# Altium schematic sheet Power.SchDoc
size A4; SheetNumber: 2; SheetTotal: 3
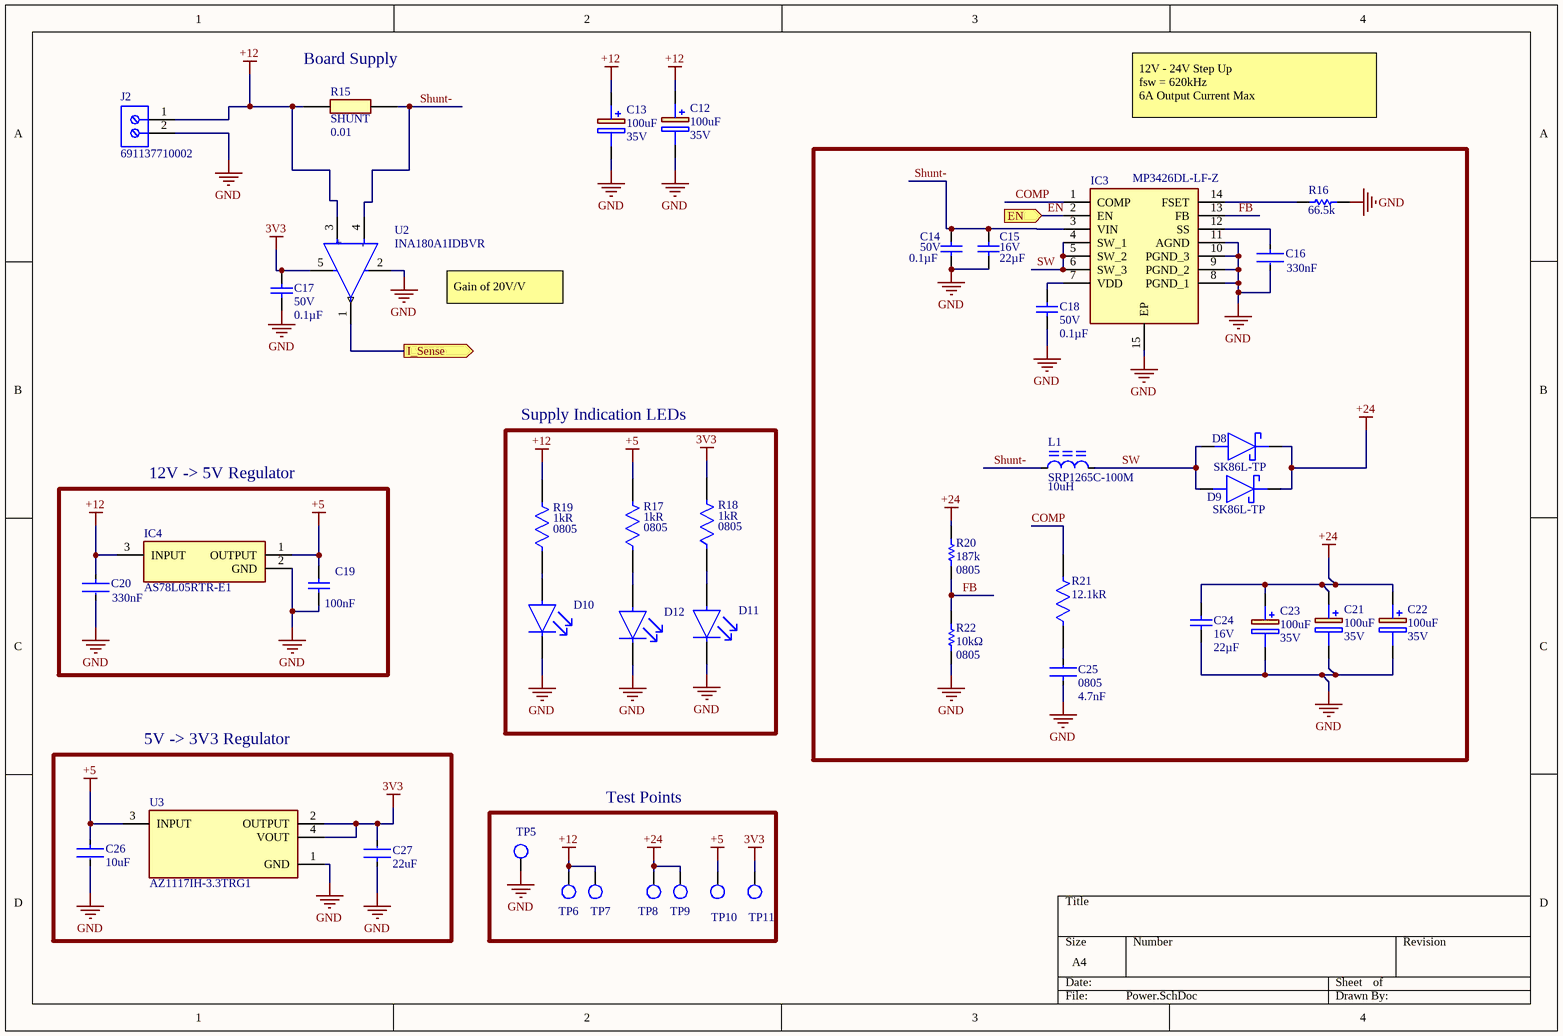
[diagram p0: Power.SchDoc]

## Parts
C12  Capacitance: 100uF  Voltage Rating: 35V  [CAPPRD250W52D630H1250]  (hidden comment: 860010573007)
C13  Capacitance: 100uF  Voltage Rating: 35V  [CAPPRD250W52D630H1250]  (hidden comment: 860010573007)
C14  Voltage - Rated: 50V  Capacitance: 0.1µF  [CAP0805]  (hidden comment: C0805C104K5RACTU)
C15  Voltage - Rated: 16V  Capacitance: 22µF  [CAP0805]  (hidden comment: CL21A226MOCLRNC)
C16  Capacitance: 330nF  [FP-CL21-F-IPC_C]  (hidden comment: CL21B334KBFNNNE)
C17  Voltage - Rated: 50V  Capacitance: 0.1µF  [CAP0805]  (hidden comment: C0805C104K5RACTU)
C18  Voltage - Rated: 50V  Capacitance: 0.1µF  [CAP0805]  (hidden comment: C0805C104K5RACTU)
C19  Capacitance: 100nF  [CAPC2013X140X50ML20T25]  (hidden comment: 08055D104KAT2A)
C20  Capacitance: 330nF  [FP-CL21-F-IPC_C]  (hidden comment: CL21B334KBFNNNE)
C21  Capacitance: 100uF  Voltage Rating: 35V  [CAPPRD250W52D630H1250]  (hidden comment: 860010573007)
C22  Capacitance: 100uF  Voltage Rating: 35V  [CAPPRD250W52D630H1250]  (hidden comment: 860010573007)
C23  Capacitance: 100uF  Voltage Rating: 35V  [CAPPRD250W52D630H1250]  (hidden comment: 860010573007)
C24  Voltage - Rated: 16V  Capacitance: 22µF  [CAP0805]  (hidden comment: CL21A226MOCLRNC)
C25  Case Code (Imperial): 0805  Capacitance: 4.7nF  [FP-CL21-IPC_A]  (hidden comment: CL21B472KBANNNC)
C26  Capacitance: 10uF  [FP-CL21-IPC_B]  (hidden comment: CL21A106KOQNNNE)
C27  Capacitance: 22uF  [FP-CL21-IPC_B]  (hidden comment: CL21A226MQQNNNG)
D8  SK86L-TP  [DIOM7959X262N]
D9  SK86L-TP  [DIOM7959X262N]
D10  150060VS75000  [FP-150060VS75000-MFG]  (value not drawn)
D11  150060VS75000  [FP-150060VS75000-MFG]  (value not drawn)
D12  150060VS75000  [FP-150060VS75000-MFG]  (value not drawn)
IC3  MP3426DL-LF-Z  [SON50P300X400X100-15N-D]
IC4  AS78L05RTR-E1  [DIODES_SOT-89]
J2  691137710002  [691137710002]
L1  SRP1265C-100M  Inductance: 10uH  [FP-SRP1265C-MFG]
R15  SHUNT  Resistance: 0.01  [RESC6434X90N]
R16  Resistance: 66.5k  [RESC2013X70X40LL20T20]  (hidden comment: ERJ-6ENF6652V)
R17  Resistance: 1kR  Size Code: 0805  [FP-RNCP0805-MFG]  (hidden comment: RNCP0805FTD1K00)
R18  Resistance: 1kR  Size Code: 0805  [FP-RNCP0805-MFG]  (hidden comment: RNCP0805FTD1K00)
R19  Resistance: 1kR  Size Code: 0805  [FP-RNCP0805-MFG]  (hidden comment: RNCP0805FTD1K00)
R20  Resistance: 187k  Package: 0805  [RESC2013X70X40NL20T20]  (hidden comment: ERJ-6ENF1873V)
R21  Resistance: 12.1kR  [FP-RNCP0805-IPC_B]  (hidden comment: RNCP0805FTD12K1)
R22  Resistance: 10kΩ  Package / Case: 0805  [RES0805]  (hidden comment: RC0805FR-0710KL)
TP5  GND  [TESTPOINT_LOOP]  (value not drawn)
TP6  12V  [TESTPOINT_LOOP]  (value not drawn)
TP7  12V  [TESTPOINT_LOOP]  (value not drawn)
TP8  24V  [TESTPOINT_LOOP]  (value not drawn)
TP9  24V  [TESTPOINT_LOOP]  (value not drawn)
TP10  5V  [TESTPOINT_LOOP]  (value not drawn)
TP11  3V3  [TESTPOINT_LOOP]  (value not drawn)
U2  INA180A1IDBVR  [FP-DBV0005A-IPC_A]
U3  AZ1117IH-3.3TRG1  [FP-SOT223-IPC_B]

## Blocks framed on the sheet
Supply Indication LEDs: D10-D12 R17-R19
12V -> 5V Regulator: C19 C20 IC4
5V -> 3V3 Regulator: C26 C27 U3
Test Points: TP5-TP11

## Ports
EN (in), I_Sense (out)

## Nets
3V3: C17.2 C27.2 R18.2 TP11.1 U2.5(VS) U3.2(OUTPUT) U3.4(VOUT)
+5: C19.2 C26.1 IC4.1(OUTPUT) R17.2 TP10.1 U3.3(INPUT)
+12: C12.1(+) C13.1(+) C20.1 IC4.3(INPUT) J2.1 R15.1 R19.2 TP6.1 TP7.1 U2.3(IN+)
+24: C21.1(+) C22.1(+) C23.1(+) C24.2 D8.1(K) D9.1(K) R20.1 TP8.1 TP9.1
GND: C12.2(-) C13.2(-) C14.1 C15.1 C16.2 C17.1 C18.1 C19.1 C20.2 C21.2(-) C22.2(-) C23.2(-) C24.1 C25.1 C26.2 C27.1 D10.1(C) D11.1(C) D12.1(C) IC3.8(PGND_1) IC3.9(PGND_2) IC3.10(PGND_3) IC3.11(AGND) IC3.15(EP) IC4.2(GND) J2.2 R16.1 R22.1 TP5.1 U2.2(GND) U3.1(GND)
COMP: IC3.1(COMP) R21.2
EN: IC3.2(EN) ; port EN
FB: IC3.13(FB) R20.2 R22.2
I_Sense: U2.1(OUT) ; port I_Sense
Shunt-: C14.2 C15.2 IC3.3(VIN) L1.1 R15.2 U2.4(IN-)
SW: D8.2(A) D9.2(A) IC3.4(SW_1) IC3.5(SW_2) IC3.6(SW_3) L1.2
NetC16_1: C16.1 IC3.12(SS)
NetC18_2: C18.2 IC3.7(VDD)
NetC25_2: C25.2 R21.1
NetD10_2: D10.2(A) R19.1
NetD11_2: D11.2(A) R18.1
NetD12_2: D12.2(A) R17.1
NetIC3_14: IC3.14(FSET) R16.2

## Notes on the sheet
- (near R15) Board Supply
- 12V - 24V Step Up
  fsw = 620kHz
  6A Output Current Max
- Gain of 20V/V
- (in symbol CMP-04895-000140-1) +; -

## Library data of the parts
C12 C13 C21-C23 = 860010573007: Capacitor Polarised; Manufacturer_Name: Wurth Elektronik; Datasheet Link: http://katalog.we-online.de/pbs/datasheet/860010573007.pdf; Height: 12.5mm; Manufacturer_Part_Number: 860010573007; Mouser Part Number: 710-860010573007; Mouser Price/Stock: https://www.mouser.co.uk/ProductDetail/Wurth-Elektronik/860010573007?qs=0KOYDY2FL2%2FkmR1S6v%2F3Lg%3D%3D
C14 C17 C18 = C0805C104K5RACTU: CAP CER 0.1UF 50V X7R 0805; Tolerance: ±10%; Supplier 1: Digi-Key; Supplier Part Number 1: 399-1170-1-ND; Temperature Coefficient: X7R; Package / Case: 0805
C15 C24 = CL21A226MOCLRNC: CAP CER 22UF 16V X5R 0805; Tolerance: ±20%; Supplier 1: Digi-Key; Supplier Part Number 1: 1276-6780-1-ND; Temperature Coefficient: X5R; Footprint: 0805
C16 C20 = CMP-13271-000003-1: CAP CER 0.33UF 50V X7R 0805; Manufacturer: Samsung Electro-Mechanics; Temperature Coefficient: 15%; Value: 330nF; Material: Ceramic; Tolerance: 10%; Category: Cap; Temperature Range Low: -55°C; Height: 1.35mm; Ipc Land Pattern Name: CAPC200125X125; ComponentLink2URL: http://www.samsungsem.com/kr/support/product-search/mlcc/__icsFiles/afieldfile/2018/07/24/CL21B334KBFNNNE.pdf; Octopart: https://octopart.com/cl21b334kbfnnne-samsung-9287149; Digikey Description: CAP CER 0.33UF 50V X7R 0805; Automotive: No; ComponentLink2Description: Datasheet; Lead Free: Yes; Voltage Rating: 50V; Device Class L2: Capacitors; Device Class L1: Passive Components; RoHS: TRUE; Manufacturer Part Number: CL21B334KBFNNNE; Temperature: -55°C to +125°C; Package: CL21-F; Temperature Range High: +125°C; Temperature Characteristic: X7R; Device Class L3: Ceramic Capacitors
C19 = CMP-2007-04689-1: Manufacturer: AVX Interconnect / Elco; Part Number: 08055D104KAT2A
C25 = CMP-13271-001405-1: CL21 Series 0805 4.7nF 50V ±10% Tolerance X7R Multilayer Ceramic Chip Capacitor; Min Operating Temperature: -55°C; Width: 0.049inch; Contact Plating: Tin; Mount: Surface Mount; Voltage Rating (DC): 50V; Tolerance: 10%; Packaging: Tape and Reel; Case Code (Metric): 2012; Package Quantity: 1; Height: 0.65mm; Radiation Hardening: No; Length: 2mm; Lead Free: Lead Free; Voltage: 50V; Thickness: 0.03inch; Max Operating Temperature: 125°C; Dielectric: X7R; Voltage Rating: 50V; Depth: 1.25mm; Material: Ceramic; Case/Package: 0805
C26 = CMP-2000-06102-2: CL21 Series 0805 10uF 16V ±10% Tolerance X5R Multilayer Ceramic Chip Capacitor; Dielectric: X7R; Length: 2mm; Depth: 1.25mm; Voltage: 16V; Width: 0.049inch; Lead Free: Lead Free; Max Operating Temperature: 85°C; Mount: Surface Mount; Voltage Rating: 16V; Height: 1.25mm; Radiation Hardening: No; Packaging: Tape and Reel; Voltage Rating (DC): 16V; Thickness: 0.055inch; Case/Package: 0805; Case Code (Imperial): 0805; Min Operating Temperature: -55°C; Case Code (Metric): 2012; Package Quantity: 1; Tolerance: 10%
C27 = CMP-13271-002967-1: CL21 Series 0805 22uF 6.3V ±20% Tolerance X5R Multilayer Ceramic Chip Capacitor; Tolerance: 20%; Case Code (Imperial): 0805; Package Quantity: 3000; Min Operating Temperature: -55°C; Case Code (Metric): 2012; Length: 2mm; Material: Ceramic; Max Operating Temperature: 85°C; Radiation Hardening: No; Packaging: Tape and Reel; Depth: 1.25mm; Mount: Surface Mount; Dielectric: X5R; Case/Package: 0805; Height: 1.25mm; Thickness: 0.055inch; Voltage: 6.3V; Width: 0.049inch; Voltage Rating: 6.3V
D8 D9 = SK86L-TP: Schottky Diode; Manufacturer_Name: Micro Commercial Components (MCC); Datasheet Link: https://www.mccsemi.com/pdf/Products/SK82L-SK810L(SMC).PDF; Height: 2.62mm; Manufacturer_Part_Number: SK86L-TP; Mouser Part Number: 833-SK86L-TP; Mouser Price/Stock: https://www.mouser.co.uk/ProductDetail/Micro-Commercial-Components-MCC/SK86L-TP?qs=Fllw7YelV3%2FmZPZoVB2kyw%3D%3D; Arrow Part Number: SK86L-TP; Arrow Price/Stock: https://www.arrow.com/en/products/sk86l-tp/micro-commercial-components?region=nac
D10-D12 = CMP-1426-00006-5: LED GREEN CLEAR 0603 SMD; Viewing Angle: 140°; Reverse Voltage (DC): 5V; Forward Voltage: 2V; Power Rating: 72mW; Lens Size: 0.7mm; Test Current: 20mA; Lens Color: Colorless; Lens Style: Rectangular; Luminous Intensity: 40mcd; Wavelength: 570nm; Length: 1.6mm; Max Operating Temperature: 85°C; Lens Transparency: Clear; Width: 0.8mm; Mount: Surface Mount; Weight: 0.000882oz; Package Quantity: 4000; Packaging: Cut Tape; RoHS Compliant: Yes; Case/Package: 0603; Series: WL-SMCW; Case Code (Metric): 1608; Illumination Color: Green; Color: Green; Case Code (Imperial): 0603; Forward Current: 20mA; Min Operating Temperature: -40°C; Height: 0.8mm; Dominant Wavelength: 570nm; Number of Pins: 2
IC3 = MP3426DL-LF-Z: Integrated Circuit; Manufacturer_Name: Monolithic Power Systems (MPS); Datasheet Link: https://www.monolithicpower.com/en/documentview/productdocument/index/version/2/document_type/Datasheet/lang/en/sku/MP3426/; Height: 1mm; Manufacturer_Part_Number: MP3426DL-LF-Z; Mouser Part Number: 946-MP3426DL-LF-Z; Mouser Price/Stock: https://www.mouser.co.uk/ProductDetail/Monolithic-Power-Systems-MPS/MP3426DL-LF-Z?qs=Z3CaLxJiOJL0MxCuEKYvhQ%3D%3D
IC4 = AS78L05RTR-E1: Integrated Circuit; Manufacturer_Name: Diodes Inc.; Datasheet Link: https://www.diodes.com/assets/Datasheets/AS78Lxx.pdf; Manufacturer_Part_Number: AS78L05RTR-E1; Mouser Part Number: 621-AS78L05RTR-E1; Mouser Price/Stock: https://www.mouser.co.uk/ProductDetail/Diodes-Incorporated/AS78L05RTR-E1?qs=FKu9oBikfSksfBIasZ7FtQ%3D%3D; Arrow Part Number: AS78L05RTR-E1; Arrow Price/Stock: https://www.arrow.com/en/products/as78l05rtr-e1/diodes-incorporated?region=asia
J2 = CMP-1502-03324-1: Series 1377 - 5.00 mm Horizontal Entry with Pressure Clamp WR-TBL, 2 pin; Manufacturer: Wurth Elektronik; Pin Number: 2; Pitch: 5.00mm; Operating Temperature: -30to120degC; Package Reference: 691137710002; Publisher: WurthElektronik; Mounting Technology: THT; Manufacturer URL: http://www.we-online.de; Packaging: Box; Part Number: 691137710002; Datasheet URL: http://katalog.we-online.de/pbs/datasheet/691137710002.pdf
L1 = CMP-07248-000045-1: FIXED IND 10UH 12A 18 MOHM SMD; Part Number: SRP1265C-100M
R15 = CRA2512-FZ-R010ELF: Resistor; Manufacturer_Name: Bourns; Datasheet Link: http://www.bourns.com/PDFs/CRA.pdf; Height: 0.9mm; Manufacturer_Part_Number: CRA2512-FZ-R010ELF; Mouser Part Number: 652-CRA2512FZR010ELF; Mouser Price/Stock: https://www.mouser.co.uk/ProductDetail/Bourns/CRA2512-FZ-R010ELF?qs=WqWCsLCZBkoNPiv%2FXVnYvw%3D%3D; Arrow Part Number: CRA2512-FZ-R010ELF; Arrow Price/Stock: https://www.arrow.com/en/products/cra2512-fz-r010elf/bourns
R16 = CMP-2001-00269-1: Manufacturer: Panasonic; Part Number: ERJ-6ENF6652V
R17-R19 = CMP-26527-001902-1: 1kΩ ±1% 0.25W 0805 High Power Anti-Sulfur Thin Film Chip Resistor; Power Rating: 250mW; Temperature Coefficient: 100ppm/°C; Series: RNCP; RoHS Compliant: Yes; Case Code (Metric): 2012; Length: 0.079inch; Case/Package: 0805; Max Power Dissipation: 250mW; Height: 0.024inch; Max Operating Temperature: 155°C; Tolerance: 1%; Min Operating Temperature: -55°C; Width: 0.049inch; Case Code (Imperial): 0805; Packaging: Tape and Reel; Mount: Surface Mount; Features: Moisture Resistant; Lead Free: Lead Free; Resistor Type: Thin Film; Number of Terminations: 2
R20 = CMP-1013-00765-2: Manufacturer: Panasonic; Part Number: ERJ-6ENF1873V
R21 = CMP-26527-004331-1: 12.1kΩ ±1% 0.25W 0805 High Power Anti-Sulfur Thin Film Chip Resistor; Temperature Coefficient: 100ppm/°C; Max Power Dissipation: 250mW; Width: 0.049inch; Mount: Surface Mount; RoHS Compliant: Yes; Min Operating Temperature: -55°C; Case/Package: 0805; Case Code (Metric): 2012; Length: 0.079inch; Number of Terminations: 2; Resistor Type: Thin Film; Series: RNCP; Packaging: Tape and Reel; Case Code (Imperial): 0805; Max Operating Temperature: 155°C; Height: 0.024inch; Features: Moisture Resistant; Tolerance: 1%
R22 = RC0805FR-0710KL: RES SMD 10K OHM 1% 1/8W 0805; Manufacturer: Yageo; Power (Watts): 0.125W, 1/8W; Temperature Coefficient: ±100ppm/°C; Supplier 1: Digi-Key; Supplier Part Number 1: 311-10.0KCRCT-ND; Tolerance: ±1%; Composition: Thick Film; Features: Moisture Resistant; Operating Temperature: -55°C ~ 155°C
TP5-TP11 = TESTPOINT_LOOP: PC TEST POINT MINIATURE WHITE; Manufacturer 1: Keystone Electronics; Manufacturer Part Number 1: 5002; Supplier Part Number 1: 36-5002-ND; Supplier 1: Digi-Key; Mount: Through Hole
U2 = CMP-04895-000140-1: IC CURR SENSE 1 CIRCUIT SOT23-5; Input Bias Current: 100nA; Input Offset Voltage (Vos): 100uV; Number of Circuits: 1; Slew Rate: 2V/µs; -3db Bandwidth: 350kHz; Operating Supply Current: 260uA; Case/Package: SOT-23-5; Min Operating Temperature: -40°C; Mount: Surface Mount; Packaging: Tape and Reel; Max Operating Temperature: 125°C
U3 = CMP-12756-000043-1: IC REG LINEAR 3.3V 1A SOT223; Output Current: 800mA; Number of Regulators: 1; Dropout Voltage: 1.2V; RoHS Compliant: Yes; Min Current Limit: 1A; Mount: Surface Mount; Packaging: Tape and Reel; Output Voltage: 3.3V; Min Operating Temperature: -40°C; Max Operating Temperature: 125°C; Number of Pins: 3; Case/Package: TO-261-4